# Altium schematic sheet Arduino.SchDoc
size A
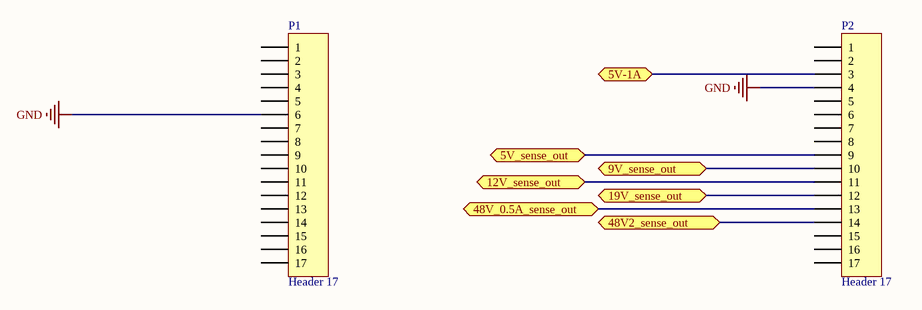
[diagram p0: Arduino.SchDoc]

## Parts
P1  Header 17  [HDR1X17]
P2  Header 17  [HDR1X17]

## Ports
5V-1A, 5V_sense_out, 9V_sense_out, 12V_sense_out, 19V_sense_out, 48V2_sense_out, 48V_0.5A_sense_out

## Nets
GND: P1.6 P2.4
5V-1A: P2.3 ; port 5V-1A
5V_sense_out: P2.9 ; port 5V_sense_out
9V_sense_out: P2.10 ; port 9V_sense_out
12V_sense_out: P2.11 ; port 12V_sense_out
19V_sense_out: P2.12 ; port 19V_sense_out
48V2_sense_out: P2.14 ; port 48V2_sense_out
48V_0.5A_sense_out: P2.13 ; port 48V_0.5A_sense_out

Not connected (* = marked no-connect by the designer): P1 1 2 3 4 5 7 8 9 10 11 12 13 14 15 16 17; P2 1 2 5 6 7 8 15 16 17

## Library data of the parts
P1 P2 = Header 17: Header, 17-Pin; LatestRevisionDate: 17-Jul-2002; LatestRevisionNote: Re-released for DXP Platform.; Publisher: Altium Limited